# EAGLE schematic CORS_Time_Reference (EAGLE 9.6.2)
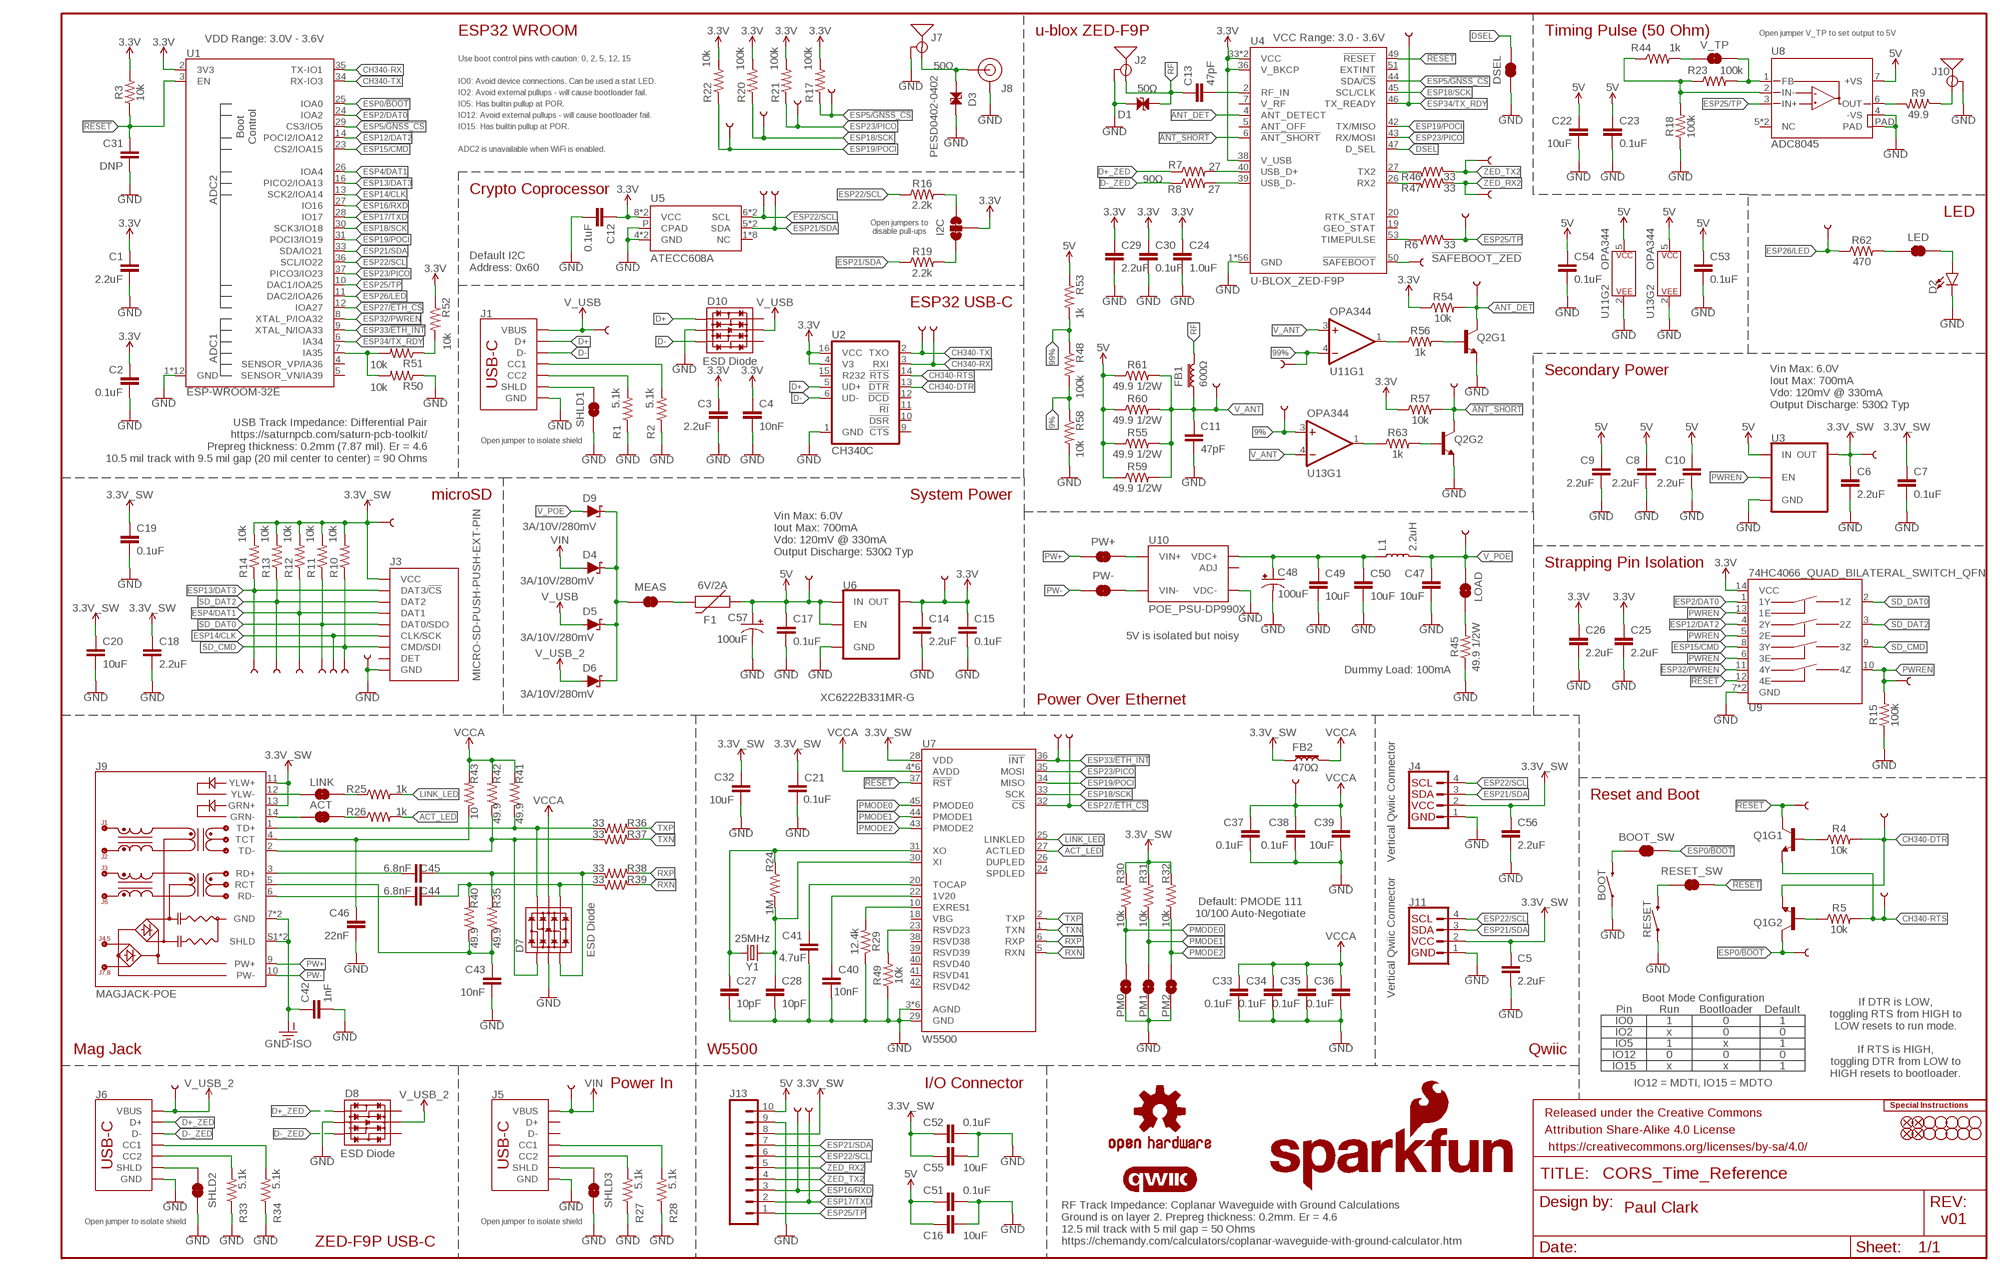
[diagram p0: schematic, sheet 1]

## Parts
3V3  TEST-POINTPOGO_PTH  [1X01_NO_SILK]
3V3_SW  TEST-POINTPOGO_PTH  [1X01_NO_SILK]
5V  TEST-POINTPOGO_PTH  [1X01_NO_SILK]
9%  TEST-POINTPOGO_PTH  [1X01_NO_SILK]
99%  TEST-POINTPOGO_PTH  [1X01_NO_SILK]
!SAFEBOOT_ZED!  TEST-POINTPOGO_PTH  [1X01_NO_SILK]
ACT  JUMPER-SMT_2_NC_TRACE_SILK  [SMT-JUMPER_2_NC_TRACE_SILK]
ANT_DET  TEST-POINTPOGO_PTH  [1X01_NO_SILK]
ANT_SHT  TEST-POINTPOGO_PTH  [1X01_NO_SILK]
BOOT  MOMENTARY-SWITCH-SPST-PTH-RIGHT-ANGLE-8-020  [TACTILE_SWITCH_PTH_RA_8-020]
BOOT_SW  JUMPER-SMT_2_NC_TRACE_SILK  [SMT-JUMPER_2_NC_TRACE_SILK]
C1  2.2uF  2.2UF-0603-10V-20%  [0603]
C2  0.1uF  0.1UF-0603-25V-5%  [0603]
C3  2.2uF  2.2UF-0603-10V-20%  [0603]
C4  10nF  10NF-0603-50V-10%  [0603]
C5  2.2uF  2.2UF-0603-10V-20%  [0603]
C6  2.2uF  2.2UF-0603-10V-20%  [0603]
C7  0.1uF  0.1UF-0603-25V-5%  [0603]
C8  2.2uF  2.2UF-0603-10V-20%  [0603]
C9  2.2uF  2.2UF-0603-10V-20%  [0603]
C10  2.2uF  2.2UF-0603-10V-20%  [0603]
C11  47pF  47PF-0603-50V-5%  [0603]
C12  0.1uF  0.1UF-0603-25V-5%  [0603]
C13  47pF  47PF-0603-50V-5%  [0603]
C14  2.2uF  2.2UF-0603-10V-20%  [0603]
C15  0.1uF  0.1UF-0603-25V-5%  [0603]
C16  10uF  10UF-0805-25V-10%  [0805]
C17  0.1uF  0.1UF-0603-25V-5%  [0603]
C18  2.2uF  2.2UF-0603-10V-20%  [0603]
C19  0.1uF  0.1UF-0603-25V-5%  [0603]
C20  10uF  10UF-0603-6.3V-20%  [0603]
C21  0.1uF  0.1UF-0603-25V-5%  [0603]
C22  10uF  10UF-0603-6.3V-20%  [0603]
C23  0.1uF  0.1UF-0603-25V-5%  [0603]
C24  1.0uF  1.0UF-0603-16V-10%  [0603]
C25  2.2uF  2.2UF-0603-10V-20%  [0603]
C26  2.2uF  2.2UF-0603-10V-20%  [0603]
C27  10pF  10PF-0603-50V-5%  [0603]
C28  10pF  10PF-0603-50V-5%  [0603]
C29  2.2uF  2.2UF-0603-10V-20%  [0603]
C30  0.1uF  0.1UF-0603-25V-5%  [0603]
C31  DNP  DNP-0603_NO_CREAM  [0603_NO_CREAM]
C32  10uF  10UF-0603-6.3V-20%  [0603]
C33  0.1uF  0.1UF-0603-25V-5%  [0603]
C34  0.1uF  0.1UF-0603-25V-5%  [0603]
C35  0.1uF  0.1UF-0603-25V-5%  [0603]
C36  0.1uF  0.1UF-0603-25V-5%  [0603]
C37  0.1uF  0.1UF-0603-25V-5%  [0603]
C38  0.1uF  0.1UF-0603-25V-5%  [0603]
C39  10uF  10UF-0603-6.3V-20%  [0603]
C40  10nF  10NF-0603-50V-10%  [0603]
C41  4.7uF  4.7UF-0603-6.3V-(10%)  [0603]
C42  1nF  1.0NF/1000PF-1206-2KV-10%  [1206]
C43  10nF  10NF-0603-50V-10%  [0603]
C44  6.8nF  6.8NF/6800PF-0603-50V-5%  [0603]
C45  6.8nF  6.8NF/6800PF-0603-50V-5%  [0603]
C46  22nF  22NF/22,000PF-0603-50V-10%  [0603]
C47  10uF  10UF-0805-25V-10%  [0805]
C48  100uF  100UF-POLAR-25V-20%(ELEC)  [PANASONIC_D]
C49  10uF  10UF-0805-25V-10%  [0805]
C50  10uF  10UF-0805-25V-10%  [0805]
C51  0.1uF  0.1UF-0603-25V-5%  [0603]
C52  0.1uF  0.1UF-0603-25V-5%  [0603]
C53  0.1uF  0.1UF-0603-25V-5%  [0603]
C54  0.1uF  0.1UF-0603-25V-5%  [0603]
C55  10uF  10UF-0603-6.3V-20%  [0603]
C56  2.2uF  2.2UF-0603-10V-20%  [0603]
C57  100uF  100UF-POLAR-25V-20%(ELEC)  [PANASONIC_D]
CLK  TEST-POINTPOGO_PTH  [1X01_NO_SILK]
CMD  TEST-POINTPOGO_PTH  [1X01_NO_SILK]
CMD1  TEST-POINTPOGO_PTH  [1X01_NO_SILK]
D1  PESD0402-0402  [0402]
D2  LED-RIGHT-ANGLE-PTH-BLUE  [CBI-RIGHT-ANGLE-PTH]
D3  PESD0402-0402  [0402]
D4  3A/10V/280mV  DIODE-SCHOTTKY-BAT60A  [SOD-323]
D5  3A/10V/280mV  DIODE-SCHOTTKY-BAT60A  [SOD-323]
D6  3A/10V/280mV  DIODE-SCHOTTKY-BAT60A  [SOD-323]
D7  ESD Diode  TVS_DIODE_ARRAY_DT1042-04SO-7  [SOT-23-6]
D8  ESD Diode  TVS_DIODE_ARRAY_DT1042-04SO-7  [SOT-23-6]
D9  3A/10V/280mV  DIODE-SCHOTTKY-BAT60A  [SOD-323]
D10  ESD Diode  TVS_DIODE_ARRAY_DT1042-04SO-7  [SOT-23-6]
DAT0  TEST-POINTPOGO_PTH  [1X01_NO_SILK]
DAT1  TEST-POINTPOGO_PTH  [1X01_NO_SILK]
DAT2  TEST-POINTPOGO_PTH  [1X01_NO_SILK]
DAT3  TEST-POINTPOGO_PTH  [1X01_NO_SILK]
DSEL  JUMPER-SMT_2_NC_TRACE_SILK  [SMT-JUMPER_2_NC_TRACE_SILK]
DTR  TEST-POINTPOGO_PTH  [1X01_NO_SILK]
ETH_CS  TEST-POINTPOGO_PTH  [1X01_NO_SILK]
ETH_INT  TEST-POINTPOGO_PTH  [1X01_NO_SILK]
F1  6V/2A  PPTC_6V2A  [1210]
FB1  600Ω  FERRITE_BEAD-0805-600Ω-100MHZ  [0805]
FB2  470Ω  FERRITE_BEAD-0603-470Ω-100MHZ-1A-200MILIΩ  [0603]
FD1  FIDUCIAL1X2  [FIDUCIAL-1X2]
FD2  FIDUCIAL1X2  [FIDUCIAL-1X2]
FD3  FIDUCIAL1X2  [FIDUCIAL-1X2]
FD4  FIDUCIAL1X2  [FIDUCIAL-1X2]
FRAME1  FRAME-LEDGER  [CREATIVE_COMMONS]
GNSS_CS  TEST-POINTPOGO_PTH  [1X01_NO_SILK]
H1  STAND-OFFTIGHT  [STAND-OFF-TIGHT]
H2  STAND-OFFTIGHT  [STAND-OFF-TIGHT]
H3  STAND-OFFTIGHT  [STAND-OFF-TIGHT]
H4  STAND-OFFTIGHT  [STAND-OFF-TIGHT]
H5  STAND-OFFTIGHT  [STAND-OFF-TIGHT]
H6  STAND-OFFTIGHT  [STAND-OFF-TIGHT]
H7  STAND-OFFTIGHT  [STAND-OFF-TIGHT]
H8  STAND-OFFTIGHT  [STAND-OFF-TIGHT]
H9  STAND-OFFTIGHT  [STAND-OFF-TIGHT]
H10  STAND-OFFTIGHT  [STAND-OFF-TIGHT]
I2C  JUMPER-SMT_3_2-NC_TRACE_SILK  [SMT-JUMPER_3_2-NC_TRACE_SILK]
J1  USB_C_4-LAYER_PADS  [USB-C-16P_4LAYER-PADS]
J2  ANTENNA-SMA-GROUNDEDEDGE_SMA  [SMA-EDGE]
J3  MICRO-SD-PUSH-PUSH-EXT-PIN  [MICROSD-EXTERNALPIN]
J4  Vertical Qwiic Connector  QWIIC_CONNECTOR  [JST04_1MM_VERT]
J5  USB_C_4-LAYER_PADS  [USB-C-16P_4LAYER-PADS]
J6  USB_C_4-LAYER_PADS  [USB-C-16P_4LAYER-PADS]
J7  ANTENNA-SMA-GROUNDEDEDGE_RPSMA  [RP-SMA-EDGE]
J8  U.FL2PIN-REDUCED-FOOTPRINT  [U.FL_REDUCED_FOOTPRINT]
J9  MAGJACK-POE  [MAGJACK-SYM_LED]
J10  ANTENNA-SMA-GROUNDEDEDGE_SMA  [SMA-EDGE]
J11  Vertical Qwiic Connector  QWIIC_CONNECTOR  [JST04_1MM_VERT]
J13  CONN_10_3.5MM_RA_HEADER  [1X10_SCREW_TERMINAL_3.5MM]
L1  2.2uH  INDUCTOR-0805_WIDE-2.2UH  [0805-WIDE]
LED  JUMPER-SMT_2_NC_TRACE_SILK  [SMT-JUMPER_2_NC_TRACE_SILK]
LINK  JUMPER-SMT_2_NC_TRACE_SILK  [SMT-JUMPER_2_NC_TRACE_SILK]
LOAD  JUMPER-SMT_2_NC_TRACE_SILK  [SMT-JUMPER_2_NC_TRACE_SILK]
LOGO1  SPECIAL_INSTRUCTIONS-ORDERING  [ORDERING_INSTRUCTIONS]
LOGO3  QWIIC_LOGO_6MM  [QWIIC_6MM]
LOGO4  OSHW-LOGOS  [OSHW-LOGO-S]
LOGO5  SFE_LOGO_NAME.2_INCH  [SFE_LOGO_NAME_.2]
LOGO6  SFE_LOGO_FLAME.2_INCH  [SFE_LOGO_FLAME_.2]
MEAS  JUMPER-COMBO_2_NC_TRACE  [COMBO-JUMPER_2_NC_TRACE]
PICO  TEST-POINTPOGO_PTH  [1X01_NO_SILK]
PM0  JUMPER-SMT_2_NO_SILK  [SMT-JUMPER_2_NO_SILK]
PM1  JUMPER-SMT_2_NO_SILK  [SMT-JUMPER_2_NO_SILK]
PM2  JUMPER-SMT_2_NO_SILK  [SMT-JUMPER_2_NO_SILK]
POCI  TEST-POINTPOGO_PTH  [1X01_NO_SILK]
PW+  JUMPER-COMBO_2_NC_TRACE  [COMBO-JUMPER_2_NC_TRACE]
PW-  JUMPER-COMBO_2_NC_TRACE  [COMBO-JUMPER_2_NC_TRACE]
PWREN  TEST-POINTPOGO_PTH  [1X01_NO_SILK]
Q1  TRANS_NPN_DUAL-MBT3904DW1T1  [SC70-6]
Q2  TRANS_NPN_DUAL-MBT3904DW1T1  [SC70-6]
R1  5.1k  5.1KOHM5.1KOHM-0603-1/10W-1%  [0603]
R2  5.1k  5.1KOHM5.1KOHM-0603-1/10W-1%  [0603]
R3  10k  10KOHM-0603-1/10W-1%  [0603]
R4  10k  10KOHM-0603-1/10W-1%  [0603]
R5  10k  10KOHM-0603-1/10W-1%  [0603]
R6  33  33OHM-0603-1/10W-1%  [0603]
R7  27  27OHM-0603-1/10W-1%  [0603]
R8  27  27OHM-0603-1/10W-1%  [0603]
R9  49.9  49.9OHM-0603-1/10W-1%  [0603]
R10  10k  10KOHM-0603-1/10W-1%  [0603]
R11  10k  10KOHM-0603-1/10W-1%  [0603]
R12  10k  10KOHM-0603-1/10W-1%  [0603]
R13  10k  10KOHM-0603-1/10W-1%  [0603]
R14  10k  10KOHM-0603-1/10W-1%  [0603]
R15  100k  100KOHM-0603-1/10W-1%  [0603]
R16  2.2k  2.2KOHM-0603-1/10W-1%  [0603]
R17  100k  100KOHM-0603-1/10W-1%  [0603]
R18  100k  100KOHM-0603-1/10W-1%  [0603]
R19  2.2k  2.2KOHM-0603-1/10W-1%  [0603]
R20  100k  100KOHM-0603-1/10W-1%  [0603]
R21  100k  100KOHM-0603-1/10W-1%  [0603]
R22  10k  10KOHM-0603-1/10W-1%  [0603]
R23  100k  100KOHM-0603-1/10W-1%  [0603]
R24  1M  1MOHM-0603-1/4W-5%  [0603]
R25  1k  1KOHM-0603-1/10W-1%  [0603]
R26  1k  1KOHM-0603-1/10W-1%  [0603]
R27  5.1k  5.1KOHM5.1KOHM-0603-1/10W-1%  [0603]
R28  5.1k  5.1KOHM5.1KOHM-0603-1/10W-1%  [0603]
R29  12.4k  12.4KOHM-0603-1/10W-1%  [0603]
R30  10k  10KOHM-0603-1/10W-1%  [0603]
R31  10k  10KOHM-0603-1/10W-1%  [0603]
R32  10k  10KOHM-0603-1/10W-1%  [0603]
R33  5.1k  5.1KOHM5.1KOHM-0603-1/10W-1%  [0603]
R34  5.1k  5.1KOHM5.1KOHM-0603-1/10W-1%  [0603]
R35  49.9  49.9OHM-0603-1/10W-1%  [0603]
R36  33  33OHM-0603-1/10W-1%  [0603]
R37  33  33OHM-0603-1/10W-1%  [0603]
R38  33  33OHM-0603-1/10W-1%  [0603]
R39  33  33OHM-0603-1/10W-1%  [0603]
R40  49.9  49.9OHM-0603-1/10W-1%  [0603]
R41  49.9  49.9OHM-0603-1/10W-1%  [0603]
R42  49.9  49.9OHM-0603-1/10W-1%  [0603]
R43  10  10OHM-0603-1/10W-1%  [0603]
R44  1k  1KOHM-0603-1/10W-1%  [0603]
R45  49.9 1/2W  49.9OHM-1206-1/2W-1%  [1206]
R46  33  33OHM-0603-1/10W-1%  [0603]
R47  33  33OHM-0603-1/10W-1%  [0603]
R48  100k  100KOHM-0603-1/10W-1%  [0603]
R49  10k  10KOHM-0603-1/10W-1%  [0603]
R50  10k  10KOHM-0603-1/10W-1%  [0603]
R51  10k  10KOHM-0603-1/10W-1%  [0603]
R52  10k  10KOHM-0603-1/10W-1%  [0603]
R53  1k  1KOHM-0603-1/10W-1%  [0603]
R54  10k  10KOHM-0603-1/10W-1%  [0603]
R55  49.9 1/2W  49.9OHM-1206-1/2W-1%  [1206]
R56  1k  1KOHM-0603-1/10W-1%  [0603]
R57  10k  10KOHM-0603-1/10W-1%  [0603]
R58  10k  10KOHM-0603-1/10W-1%  [0603]
R59  49.9 1/2W  49.9OHM-1206-1/2W-1%  [1206]
R60  49.9 1/2W  49.9OHM-1206-1/2W-1%  [1206]
R61  49.9 1/2W  49.9OHM-1206-1/2W-1%  [1206]
R62  470  470OHM-0603-1/10W-1%  [0603]
R63  1k  1KOHM-0603-1/10W-1%  [0603]
RESET  MOMENTARY-SWITCH-SPST-PTH-RIGHT-ANGLE-8-020  [TACTILE_SWITCH_PTH_RA_8-020]
RESET_SW  JUMPER-SMT_2_NC_TRACE_SILK  [SMT-JUMPER_2_NC_TRACE_SILK]
RTS  TEST-POINTPOGO_PTH  [1X01_NO_SILK]
RX  TEST-POINTPOGO_PTH  [1X01_NO_SILK]
RX2  TEST-POINTPOGO_PTH  [1X01_NO_SILK]
RXD  TEST-POINTPOGO_PTH  [1X01_NO_SILK]
SCK  TEST-POINTPOGO_PTH  [1X01_NO_SILK]
SCL  TEST-POINTPOGO_PTH  [1X01_NO_SILK]
SDA  TEST-POINTPOGO_PTH  [1X01_NO_SILK]
SHLD1  JUMPER-SMT_2_NC_TRACE_SILK  [SMT-JUMPER_2_NC_TRACE_SILK]
SHLD2  JUMPER-SMT_2_NC_TRACE_SILK  [SMT-JUMPER_2_NC_TRACE_SILK]
SHLD3  JUMPER-SMT_2_NC_TRACE_SILK  [SMT-JUMPER_2_NC_TRACE_SILK]
TP  TEST-POINTPOGO_PTH  [1X01_NO_SILK]
TP_BOOT  TEST-POINTPOGO_PTH  [1X01_NO_SILK]
TP_LED  TEST-POINTPOGO_PTH  [1X01_NO_SILK]
TP_RESET  TEST-POINTPOGO_PTH  [1X01_NO_SILK]
TX  TEST-POINTPOGO_PTH  [1X01_NO_SILK]
TX2  TEST-POINTPOGO_PTH  [1X01_NO_SILK]
TX_RDY  TEST-POINTPOGO_PTH  [1X01_NO_SILK]
TXD  TEST-POINTPOGO_PTH  [1X01_NO_SILK]
U1  ESP-WROOM-32E  ESP-WROOM-32EU  [ESP-WROOM-32EU]
U2  CH340C  [SO016]
U3  XC6222B331MR-G  [SOT23-5]
U4  U-BLOX_ZED-F9P  [ZED-F9P]
U5  ATECC608A  ATECC608ADUAL_PACKAGE_UDFN_SOIC-8  [DUAL_UDFN_2X3MM_SOIC-8]
U6  XC6222B331MR-G  [SOT23-5]
U7  W5500  [LQFP-48]
U8  ADC8045  AD8045-PAD  [SO08_PAD]
U9  74HC4066_QUAD_BILATERAL_SWITCH_QFN  [14-QFN]
U10  POE_PSU-DP990X  [DP990X]
U11  OPA344  [SOT23-5]
U13  OPA344  [SOT23-5]
V_TP  JUMPER-SMT_2_NC_TRACE_SILK  [SMT-JUMPER_2_NC_TRACE_SILK]
VANT  TEST-POINTPOGO_PTH  [1X01_NO_SILK]
VCCA  TEST-POINTPOGO_PTH  [1X01_NO_SILK]
VIN  TEST-POINTPOGO_PTH  [1X01_NO_SILK]
VPOE  TEST-POINTPOGO_PTH  [1X01_NO_SILK]
VPOE7  TEST-POINTPOGO_PTH  [1X01_NO_SILK]
VUSB  TEST-POINTPOGO_PTH  [1X01_NO_SILK]
VUSB2  TEST-POINTPOGO_PTH  [1X01_NO_SILK]
Y1  25MHz  CRYSTAL-25MHZ-SMD-2.0X1.6MM  [CRYSTAL-SMD-2.0X1.6MM]

## Nets
3.3V: 3V3.1 C1.1 C2.1 C3.1 C4.1 C12.1 C14.1 C15.1 C24.1 C25.1 C26.1 C29.1 C30.1 I2C.2 R3.2 R17.2 R20.2 R21.2 R22.2 R52.1 R54.1 R57.1 U1.2(3V3) U2.4(V3) U2.16(VCC) U4.33(VCC) U4.34(VCC) U4.36(V_BKCP) U4.38(V_USB) U5.8(VCC) U5.8S(VCC) U6.5(OUT) U9.14(VCC)
3.3V_SW: 3V3_SW.1 C5.1 C6.1 C7.1 C18.1 C19.1 C20.1 C21.1 C32.1 C52.1 C55.1 C56.1 CMD1.1 FB2.1 J3.4(VCC) J4.2 J9.11(YLW+) J9.13(GRN+) J11.2 J13.8 R10.2 R11.2 R12.2 R13.2 R14.2 R30.2 R31.2 R32.2 U3.5(OUT) U7.28(VDD)
5V: 5V.1 C8.1 C9.1 C10.1 C16.1 C17.1 C22.1 C23.1 C51.1 C53.1 C54.1 C57.+ F1.1 J13.10 R53.1 R55.1 R59.1 R60.1 R61.1 U3.1(IN) U6.1(IN) U6.3(EN) U8.7(+VS) U11.5(P$V+) U13.5(P$V+)
5V_RAW: C48.+ C49.1 C50.1 L1.1 U10.1(VDC+) U10.2(VDC+)
9%: 9%.1 R48.2 R58.1 U13.3(+IN)
99%: 99%.1 R48.1 R53.2 U11.4(-IN)
!ANT_SHORT!: ANT_SHT.1 Q2.6(C) R57.2 U4.6(!ANT_SHORT!)
!RESET!: C31.1 Q1.3(C) R3.1 RESET_SW.1 TP_RESET.1 U1.3(EN) U4.49(!RESET!) U7.37(!RST!) U9.12(4E)
!SAFEBOOT_ZED!: !SAFEBOOT_ZED!.1 U4.50(!SAFEBOOT!)
ACT: ACT.1 J9.14(GRN-)
ACT_LED: R26.2 U7.27(ACTLED)
ANT_DET: ANT_DET.1 Q2.3(C) R54.2 U4.4(ANT_DETECT)
CH340-DTR: DTR.1 Q1.1(E) R4.2 U2.13(!DTR)
CH340-RTS: Q1.4(E) R5.2 RTS.1 U2.14(!RTS)
CH340-RX: TX.1 U1.35(TX-IO1) U2.3(RXI)
CH340-TX: RX.1 U1.34(RX-IO3) U2.2(TXO)
D+: D10.1(IO1) J1.A6(D+) J1.B6(D+) U2.5(UD+)
D+_ZED: D8.1(IO1) J6.A6(D+) J6.B6(D+) R7.1
D-: D10.3(IO2) J1.A7(D-) J1.B7(D-) U2.6(UD-)
D-_ZED: D8.3(IO2) J6.A7(D-) J6.B7(D-) R8.1
DSEL: DSEL.2 U4.47(D_SEL)
ESP0/!BOOT!: BOOT_SW.1 Q1.6(C) TP_BOOT.1 U1.25(IOA0)
ESP2/DAT0: U1.24(IOA2) U9.1(1Y)
ESP4/DAT1: DAT1.1 J3.8(DAT1) R12.1 U1.26(IOA4)
ESP5/!GNSS_CS!: GNSS_CS.1 R17.1 U1.29(CS3/IO5) U4.44(SDA/!CS!)
ESP12/DAT2: U1.14(POCI2/IOA12) U9.4(2Y)
ESP13/DAT3: DAT3.1 J3.2(DAT3/!CS!) R14.1 U1.16(PICO2/IOA13)
ESP14/CLK: CLK.1 J3.5(CLK/SCK) U1.13(SCK2/IOA14)
ESP15/CMD: U1.23(CS2/IOA15) U9.8(3Y)
ESP16/RXD: J13.3 RXD.1 U1.27(IO16)
ESP17/TXD: J13.2 TXD.1 U1.28(IO17)
ESP18/SCK: R20.1 SCK.1 U1.30(SCK3/IO18) U4.45(SCL/CLK) U7.33(SCK)
ESP19/POCI: POCI.1 R22.1 U1.31(POCI3/IO19) U4.42(TX/MISO) U7.34(MISO)
ESP21/SDA: J4.3 J11.3 J13.7 R19.1 SDA.1 U1.33(SDA/IO21) U5.5(SDA) U5.5S(SDA)
ESP22/SCL: J4.4 J11.4 J13.6 R16.1 SCL.1 U1.36(SCL/IO22) U5.6(SCL) U5.6S(SCL)
ESP23/PICO: PICO.1 R21.1 U1.37(PICO3/IO23) U4.43(RX/MOSI) U7.35(MOSI)
ESP25/TP: J13.1 R6.2 TP.1 U1.10(DAC1/IOA25) U8.3(IN+)
ESP26/LED: R62.1 TP_LED.1 U1.11(DAC2/IOA26)
ESP27/!ETH_CS!: ETH_CS.1 U1.12(IOA27) U7.32(!CS!)
ESP32/PWREN: U1.8(XTAL_P/IOA32) U9.11(4Y)
ESP33/!ETH_INT!: ETH_INT.1 U1.9(XTAL_N/IOA33) U7.36(!INT!)
ESP34/TX_RDY: TX_RDY.1 U1.6(IA34) U4.46(TX_READY)
GND: BOOT.1 C1.2 C2.2 C3.2 C4.2 C5.2 C6.2 C7.2 C8.2 C9.2 C10.2 C11.2 C12.2 C14.2 C15.2 C16.2 C17.2 C18.2 C19.2 C20.2 C21.2 C22.2 C23.2 C24.2 C25.2 C26.2 C27.2 C28.2 C29.2 C30.2 C31.2 C32.2 C33.2 C34.2 C35.2 C36.2 C37.2 C38.2 C39.2 C40.2 C41.2 C42.2 C43.2 C46.2 C47.2 C48.- C49.2 C50.2 C51.2 C52.2 C53.2 C54.2 C55.2 C56.2 C57.- D1.2 D2.C D3.2 D7.2(VSS) D8.2(VSS) D10.2(VSS) DSEL.1 J1.GND J1.GND2(GND) J2.GND@0(GND) J2.GND@1(GND) J2.GND@2(GND) J2.GND@3(GND) J3.6(GND) J3.10(GND) J3.11(GND) J3.12(GND) J3.13(GND) J4.1 J5.GND J5.GND2(GND) J6.GND J6.GND2(GND) J7.GND@0(GND) J7.GND@1(GND) J7.GND@2(GND) J7.GND@3(GND) J8.1(GND) J8.2(GND) J10.GND@0(GND) J10.GND@1(GND) J10.GND@2(GND) J10.GND@3(GND) J11.1 J13.9 PM0.1 PM1.1 PM2.1 Q2.1(E) Q2.4(E) R1.1 R2.1 R15.1 R18.1 R27.1 R28.1 R29.1 R33.1 R34.1 R45.1 R49.1 R50.1 R58.2 RESET.1 SHLD1.1 SHLD2.1 SHLD3.1 U1.1(GND) U1.15(GND) U1.38(GND) U1.GND U1.GNDT1(GND) U1.GNDT2(GND) U1.GNDT3(GND) U1.GNDT4(GND) U1.GNDT5(GND) U1.GNDT6(GND) U1.GNDT7(GND) U1.GNDT8(GND) U2.1(GND) U3.2(GND) U4.1(GND) U4.3(GND) U4.12(GND) U4.14(GND) U4.32(GND) U4.37(GND) U4.41(GND) U4.48(GND) U4.55(GND) U4.56(GND) U4.57(GND) U4.58(GND) U4.59(GND) U4.60(GND) U4.61(GND) U4.62(GND) U4.63(GND) U4.64(GND) U4.65(GND) U4.66(GND) U4.67(GND) U4.68(GND) U4.69(GND) U4.70(GND) U4.71(GND) U4.72(GND) U4.73(GND) U4.74(GND) U4.75(GND) U4.76(GND) U4.77(GND) U4.78(GND) U4.79(GND) U4.80(GND) U4.81(GND) U4.82(GND) U4.83(GND) U4.84(GND) U4.85(GND) U4.86(GND) U4.87(GND) U4.88(GND) U4.89(GND) U4.90(GND) U4.91(GND) U4.92(GND) U4.93(GND) U4.94(GND) U4.95(GND) U4.96(GND) U4.97(GND) U4.98(GND) U4.99(GND) U4.100(GND) U4.101(GND) U4.102(GND) U5.4(GND) U5.4S(GND) U5.P(CPAD) U6.2(GND) U7.3(AGND) U7.9(AGND) U7.14(AGND) U7.16(AGND) U7.19(AGND) U7.29(GND) U7.48(AGND) U8.4(-VS) U8.PAD U9.7(GND) U9.EPAD(GND) U10.3(VDC-) U11.2(P$V-) U13.2(P$V-) VPOE7.1
GND-ISO: C42.1 J9.7(GND) J9.8(GND) J9.S1(SHLD) J9.S2(SHLD)
LINK: J9.12(YLW-) LINK.1
LINK_LED: R25.2 U7.25(LINKLED)
MEAS: D4.C D5.C D6.C D9.C MEAS.2 MEAS.4
N$1: J1.B5(CC2) R1.2
N$2: J1.A5(CC1) R2.2
N$3: R7.2 U4.40(USB_D+)
N$4: Q1.2(B) R5.1
N$5: Q1.5(B) R4.1
N$6: R8.2 U4.39(USB_D-)
N$7: LED.2 R62.2
N$8: J6.SHLD1(SHLD) J6.SHLD2(SHLD) J6.SHLD3(SHLD) J6.SHLD4(SHLD) SHLD2.2
N$9: J5.B5(CC2) R27.2
N$10: F1.2 MEAS.1 MEAS.3
N$11: R46.1 U4.27(TX2)
N$12: ACT.2 R26.1
N$13: D3.1 J7.SIG(SIGNAL) J8.FEED(SIGNAL)
N$14: I2C.3 R16.2
N$15: I2C.1 R19.2
N$16: R9.2 U8.6(OUT)
N$17: J10.SIG(SIGNAL) R9.1
N$18: R18.2 R23.1 R44.1 U8.2(IN-)
N$19: C27.1 R24.1 U7.31(XO) Y1.1
N$20: C28.1 R24.2 U7.30(XI) Y1.3
N$21: LINK.2 R25.1
N$22: J5.A5(CC1) R28.2
N$23: R29.2 U7.10(EXRES1)
N$24: C40.1 U7.22(1V20)
N$25: C41.1 U7.20(TOCAP)
N$26: R23.2 U8.1(FB) V_TP.2
N$27: LOAD.1 R45.2
N$28: RESET.2 RESET_SW.2
N$29: BOOT.2 BOOT_SW.2
N$30: R49.2 U7.23(RSVD23)
N$31: R44.2 V_TP.1
N$32: R47.1 U4.26(RX2)
N$33: J6.B5(CC2) R33.2
N$34: J6.A5(CC1) R34.2
N$35: R56.1 U11.1(OUT)
N$36: R6.1 U4.53(TIMEPULSE)
N$37: R50.2 R51.2 U1.7(IA35)
N$38: Q2.5(B) R56.2
N$39: R51.1 R52.2
N$40: Q2.2(B) R63.2
N$41: R63.1 U13.1(OUT)
N$42: C13.2 U4.2(RF_IN)
N$43: J5.SHLD1(SHLD) J5.SHLD2(SHLD) J5.SHLD3(SHLD) J5.SHLD4(SHLD) SHLD3.2
N$45: D2.A LED.1
PMODE0: PM0.2 R30.1 U7.45(PMODE0)
PMODE1: PM1.2 R31.1 U7.44(PMODE1)
PMODE2: PM2.2 R32.1 U7.43(PMODE2)
PW1+: PW+.1 PW+.3 U10.5(VIN+) U10.6(VIN+)
PW1-: PW-.1 PW-.3 U10.7(VIN-) U10.8(VIN-)
PW+: J9.9(PW+) PW+.2 PW+.4
PW-: J9.10(PW-) PW-.2 PW-.4
PWREN: PWREN.1 R15.2 U3.3(EN) U9.5(2E) U9.6(3E) U9.10(4Z) U9.13(1E)
RCT: C43.1 J9.5(RCT) R35.1 R40.1
RD+: C45.2 J9.3(RD+)
RD-: C44.2 J9.6(RD-)
RF: C13.1 D1.1 FB1.2 J2.SIG(SIGNAL)
RXN: R39.1 U7.5(RXN)
RXN1: C44.1 D7.4(IO3) R39.2 R40.2
RXP: R38.1 U7.6(RXP)
RXP1: C45.1 D7.3(IO2) R35.2 R38.2
SD_CMD: CMD.1 J3.3(CMD/SDI) R10.1 U9.9(3Z)
SD_DAT0: DAT0.1 J3.7(DAT0/SDO) R11.1 U9.2(1Z)
SD_DAT2: DAT2.1 J3.1(DAT2) R13.1 U9.3(2Z)
SHIELD: J1.SHLD1(SHLD) J1.SHLD2(SHLD) J1.SHLD3(SHLD) J1.SHLD4(SHLD) SHLD1.2
TCT: C46.1 J9.4(TCT) R43.1
TD+: D7.6(IO4) J9.1(TD+) R36.2 R41.1
TD-: D7.1(IO1) J9.2(TD-) R37.2 R42.1
TXN: R37.1 U7.1(TXN)
TXP: R36.1 U7.2(TXP)
V_ANT: C11.1 FB1.1 R55.2 R59.2 R60.2 R61.2 U11.3(+IN) U13.4(-IN) VANT.1
V_POE: C47.1 D9.A L1.2 LOAD.2 VPOE.1
V_USB: D5.A D10.5(VCC) J1.VBUS1(VBUS) J1.VBUS2(VBUS) VUSB.1
V_USB_2: D6.A D8.5(VCC) J6.VBUS1(VBUS) J6.VBUS2(VBUS) VUSB2.1
VCCA: C33.1 C34.1 C35.1 C36.1 C37.1 C38.1 C39.1 D7.5(VCC) FB2.2 R41.2 R42.2 R43.2 U7.4(AVDD) U7.8(AVDD) U7.11(AVDD) U7.15(AVDD) U7.17(AVDD) U7.21(AVDD) VCCA.1
VIN: D4.A J5.VBUS1(VBUS) J5.VBUS2(VBUS) VIN.1
ZED_RX2: J13.5 R47.2 RX2.1
ZED_TX2: J13.4 R46.2 TX2.1
Unconnected: D8.4(IO3) D8.6(IO4) D10.4(IO3) D10.6(IO4) J3.9(DET) J5.A6(D+) J5.A7(D-) J5.B6(D+) J5.B7(D-) U1.4(SENSOR_VP/IA36) U1.5(SENSOR_VN/IA39) U2.9(!CTS) U2.10(!DSR) U2.11(!RI) U2.12(!DCD) U2.15(R232) U4.5(ANT_OFF) U4.7(V_RF) U4.19(GEO_STAT) U4.20(RTK_STAT) U4.51(EXTINT) U5.1(NC) U5.1S(NC) U5.2(NC) U5.2S(NC) U5.3(NC) U5.3S(NC) U5.7(NC) U5.7S(NC) U7.18(VBG) U7.24(SPDLED) U7.26(DUPLED) U7.38(RSVD38) U7.39(RSVD39) U7.40(RSVD40) U7.41(RSVD41) U7.42(RSVD42) U8.5(NC) U8.8(NC) U10.4(ADJ)

## Notes on the sheet
- u-blox ZED-F9P | Timing Pulse (50 Ohm)
- VDD Range: 3.0V - 3.6V | ESP32 WROOM | Open jumper V_TP to set output to 5V
- VCC Range: 3.0 - 3.6V
- Use boot control pins with caution: 0, 2, 5, 12, 15
- 50Ω
- IO0: Avoid device connections. Can be used a stat LED.
- IO2: Avoid external pullups - will cause bootloader fail. | 50Ω
- IO5: Has builtin pullup at POR.
- IO12: Avoid external pullups - will cause bootloader fail.
- IO15: Has builtin pullup at POR.
- ADC2 is unavailable when WiFi is enabled.
- Crypto Coprocessor | 90Ω
- LED
- Open jumpers to
  disable pull-ups
- Default I2C
  Address: 0x60
- ESP32 USB-C
- Secondary Power
- Vin Max: 6.0V
  Iout Max: 700mA
  Vdo: 120mV @ 330mA
  Output Discharge: 530Ω Typ
- USB Track Impedance: Differential Pair
  https://saturnpcb.com/saturn-pcb-toolkit/
  Prepreg thickness: 0.2mm (7.87 mil). Er = 4.6
  10.5 mil track with 9.5 mil gap (20 mil center to center) = 90 Ohms
- Open jumper to isolate shield
- microSD | System Power
- Vin Max: 6.0V
  Iout Max: 700mA
  Vdo: 120mV @ 330mA
  Output Discharge: 530Ω Typ
- Strapping Pin Isolation
- 5V is isolated but noisy
- Dummy Load: 100mA
- Power Over Ethernet
- Reset and Boot
- Default: PMODE 111
  10/100 Auto-Negotiate
- Boot Mode Configuration
- If DTR is LOW,
  toggling RTS from HIGH to
  LOW resets to run mode.
  
  If RTS is HIGH,
  toggling DTR from LOW to
  HIGH resets to bootloader.
- Pin | Run | Bootloader | Default
- IO0 | 1 | 0 | 1
- IO2 | x | 0 | 0
- IO5 | 1 | x | 1
- Mag Jack | W5500 | Qwiic | IO12 | 0 | 0 | 0
- IO15 | x | x | 1
- Power In | I/O Connector
- IO12 = MDTI, IO15 = MDTO
- Paul Clark
- Open jumper to isolate shield | Open jumper to isolate shield | v01
- RF Track Impedance: Coplanar Waveguide with Ground Calculations
  Ground is on layer 2. Prepreg thickness: 0.2mm. Er = 4.6
  12.5 mil track with 5 mil gap = 50 Ohms
  https://chemandy.com/calculators/coplanar-waveguide-with-ground-calculator.htm
- ZED-F9P USB-C

## Library data of the parts
3V3 3V3_SW 5V 9% 99% !SAFEBOOT_ZED! ANT_DET ANT_SHT CLK CMD CMD1 DAT0 DAT1-DAT3 DTR ETH_CS ETH_INT GNSS_CS PICO POCI PWREN RTS RX RX2 RXD SCK SCL SDA TP TP_BOOT TP_LED TP_RESET TX TX2 TX_RDY TXD VANT VCCA VIN VPOE VPOE7 VUSB VUSB2 = SparkFun-Connectors:TEST-POINT: SparkFun Test Points Bare copper test points for troubleshooting or In-Circuit-Testing. These are used by our Production team for verifying production board runs using pogo-pins on test beds. SparkFun Products: SparkFun LSM9DS1 Breakout <https://www.sparkfun.com/products/13284> SparkFun PSOC <https://www.sparkfun.com/products/13714> SparkFun Load Cell Amplifier <https://www.sparkfun.com/products/13879>
ACT BOOT_SW DSEL LED LINK LOAD RESET_SW SHLD1-SHLD3 V_TP = SparkFun-Jumpers:JUMPER-SMT_2_NC_TRACE: Normally closed trace jumper This jumper has a trace between two pads so it's normally closed (NC). Use a razor knife to open the connection. For best results follow the IPC guidelines for cutting traces: Cutout at least 0.063 mm (0.005 in). Remove all loose material to clean up the cut area. Seal the cut with an approved epoxy. Reapply solder to reclose the connection.
BOOT RESET = SparkFun-Switches:MOMENTARY-SWITCH-SPST: Momentary Switch (Pushbutton) - SPST Normally-open (NO) SPST momentary switches (buttons, pushbuttons). Variants PTH-12MM - 12mm square, through-hole Momentary Pushbutton Switch - 12mm Square <https://www.sparkfun.com/products/9190> (COM-09190) PTH-6.0MM, PTH-6.0MM-KIT - 6.0mm square, through-hole Mini Pushbutton Switch <https://www.sparkfun.com/products/97> (COM-00097) KIT package intended for soldering kit's - only one side of pads' copper is exposed. PTH-RIGHT-ANGLE-KIT - Right-angle, through-hole Right Angle Tactile Button <https://www.sparkfun.com/products/10791> - Used on SparkFun BigTime Watch Kit <https://www.sparkfun.com/products/11734> SMD-12MM - 12mm square, surface-mount Tactile Button - SMD (12mm) <https://www.sparkfun.com/products/12993> (COM-12993) Used on SparkFun PicoBoard <https://www.sparkfun.com/products/11888> SMD-4.5MM - 4.5mm Square Trackball Switch Used on SparkFun Blackberry Trackballer Breakout <https://www.sparkfun.com/products/13169> SMD-4.6MMX2.8MM - 4.60mm x 2.80mm, surface mount Used on SparkFun Pro Micro - RP2040 <https://www.sparkfun.com/products/17717> SMD-5.2MM, SMD-5.2-REDUNDANT - 5.2mm square, surface-mount Mini Pushbutton Switch - SMD <https://www.sparkfun.com/products/8720> (COM-08720) Used on Arduino Pro Mini <https://www.sparkfun.com/products/11114> REDUNDANT package connects both switch circuits together SMD-6.0X3.5MM - 6.0 x 3.5mm, surface mount Momentary Reset Switch SMD <https://www.sparkfun.com/products/8229> (COM-08229) SMD-6.2MM-TALL - 6.2mm square, surface mount Tactile Button - SMD (6mm) <https://www.sparkfun.com/products/12992> Used on SparkFun Digital Sandbox <https://www.sparkfun.com/products/12651> SMD-RIGHT-ANGLE - Right-angle, surface mount Used on SparkFun Block for Intel® Edison - Arduino <https://www.sparkfun.com/products/13036>; PROD_ID: SWCH-13896
C1 C3 C5 C6 C8-C10 C14 C18 C25 C26 C29 C56 = SparkFun-Capacitors:2.2UF: 2.2µF ceramic capacitors A capacitor is a passive two-terminal electrical component used to store electrical energy temporarily in an electric field.; PROD_ID: CAP-07888
C2 C7 C12 C15 C17 C19 C21 C23 C30 C33-C38 C51-C54 = SparkFun-Capacitors:0.1UF: 0.1µF ceramic capacitors A capacitor is a passive two-terminal electrical component used to store electrical energy temporarily in an electric field.; PROD_ID: CAP-08604
C4 C40 C43 = SparkFun-Capacitors:10NF: 0.01uF/10nF/10,000pF ceramic capacitors A capacitor is a passive two-terminal electrical component used to store electrical energy temporarily in an electric field. CAP-09321; PROD_ID: CAP-00867
C11 C13 = SparkFun-Capacitors:47PF: 47pF ceramic capacitors A capacitor is a passive two-terminal electrical component used to store electrical energy temporarily in an electric field.; PROD_ID: CAP-08913
C16 C47 C49 C50 = SparkFun-Capacitors:10UF: 10.0µF ceramic capacitors A capacitor is a passive two-terminal electrical component used to store electrical energy temporarily in an electric field.; PROD_ID: CAP-14259
C20 C22 C32 C39 C55 = SparkFun-Capacitors:10UF: 10.0µF ceramic capacitors A capacitor is a passive two-terminal electrical component used to store electrical energy temporarily in an electric field.; PROD_ID: CAP-11015
C24 = SparkFun-Capacitors:1.0UF: 1µF ceramic capacitors A capacitor is a passive two-terminal electrical component used to store electrical energy temporarily in an electric field.; PROD_ID: CAP-00868
C27 C28 = SparkFun-Capacitors:10PF: 10pF ceramic capacitors A capacitor is a passive two-terminal electrical component used to store electrical energy temporarily in an electric field.; PROD_ID: CAP-11812
C31 = SparkFun-Capacitors:DNP: Do-Not-Populate capacitor
C41 = SparkFun-Capacitors:4.7UF: 4.7µF ceramic capacitors A capacitor is a passive two-terminal electrical component used to store electrical energy temporarily in an electric field.; PROD_ID: CAP-08280
C42 = SparkFun-Capacitors:1.0NF/1000PF: 1nF/1,000pF ceramic capacitors A capacitor is a passive two-terminal electrical component used to store electrical energy temporarily in an electric field.; PROD_ID: CAP-16238
C44 C45 = SparkFun-Capacitors:6.8NF/6800PF: 5.6nF/5600pF ceramic capacitors A capacitor is a passive two-terminal electrical component used to store electrical energy temporarily in an electric field.; PROD_ID: CAP-16239
C46 = SparkFun-Capacitors:22NF/22,000PF: 0.022uF/22nF/22,000pF ceramic capacitors A capacitor is a passive two-terminal electrical component used to store electrical energy temporarily in an electric field.; PROD_ID: CAP-07885
C48 C57 = SparkFun-Capacitors:100UF-POLAR: 100µF polarized capacitors A capacitor is a passive two-terminal electrical component used to store electrical energy temporarily in an electric field.; PROD_ID: CAP-12547
D1 D3 = SparkFun-DiscreteSemi:PESD0402: ESD protection diode PESD is used to protect a signal line from ESD.; DIGIKEY_PART: PESD0402-140CT-ND; MOUSE_PART: 650-PESD0402-140; PROD_ID: DIO-15359
D2 = SparkFun-LED:LED-RIGHT-ANGLE-PTH; PROD_ID: DIO-13890
D4-D6 D9 = SparkFun-DiscreteSemi:DIODE-SCHOTTKY: Schottky diode A Schottky diode is a semiconductor diode which has a low forward voltage drop and a very fast switching action.; PROD_ID: DIO-14072
D7 D8 D10 = SparkFun-DiscreteSemi:TVS_DIODE_ARRAY; PROD_ID: IC-13538
F1 = SparkFun-Fuses:PPTC: Resettable Fuse PPTC Resettable Fuse. Really a sort of resistor with a polymeric positive temperature coefficient whose resistance increases dramatically with an increase in temperature. When heated by the power passing through the resistance rises causing the current to be limited, protecting the circuit. This is achieved by the transition of the polymer from a crystalline to an amorphous state where the conductive carbon separates breaking the conductive pathways found in the cool crystalline structure. When a PPTC cools back down it resumes conducting letting the circuit turn back on. SparkFun Products: SparkFun RedBoard - Programmed with Arduino <https://www.sparkfun.com/products/12757> Pro Micro - 5V/16MHz <https://www.sparkfun.com/products/12640> Arduino Pro 328 - 5V/16MHz <https://www.sparkfun.com/products/10915> MP3 Trigger <https://www.sparkfun.com/products/13720>; PROD_ID: RES-14313
FB1 = SparkFun-Coils:FERRITE_BEAD: Ferrite Bead (blocks, cores, rings, chokes, etc.) Inductor with layers of ferrite used to suppress high frequencies. Often used to isolate high frequency noise. SparkFun Products: IOIO-OTG - V2.2 <https://www.sparkfun.com/products/13613> SparkFun SAMD21 Mini Breakout <https://www.sparkfun.com/products/13664> SparkFun 6 Degrees of Freedom Breakout - LSM6DS3 <https://www.sparkfun.com/products/13339> SparkFun SAMD21 Dev Breakout <https://www.sparkfun.com/products/13672> Lilypad MP3 <https://www.sparkfun.com/products/11013>; PROD_ID: NDUC-14988
FB2 = SparkFun-Coils:FERRITE_BEAD: Ferrite Bead (blocks, cores, rings, chokes, etc.) Inductor with layers of ferrite used to suppress high frequencies. Often used to isolate high frequency noise. SparkFun Products: IOIO-OTG - V2.2 <https://www.sparkfun.com/products/13613> SparkFun SAMD21 Mini Breakout <https://www.sparkfun.com/products/13664> SparkFun 6 Degrees of Freedom Breakout - LSM6DS3 <https://www.sparkfun.com/products/13339> SparkFun SAMD21 Dev Breakout <https://www.sparkfun.com/products/13672> Lilypad MP3 <https://www.sparkfun.com/products/11013>; PROD_ID: NDUC-12579
FD1-FD4 = SparkFun-Aesthetics:FIDUCIAL: Fiducial Alignment Points Point-of-reference for pick-and-place machines and other optical instruments.
FRAME1 = SparkFun-Aesthetics:FRAME-LEDGER: Schematic Frame - Ledger Standard 11x14 US Ledger frame
H1-H10 = SparkFun-Hardware:STAND-OFF: Stand Off Drill holes for mechanically mounting via screws, standoffs, etc. Note: Use the keepout ring to avoid running the screw head into surrounding components. Variant Overviews STAND-OFF - Mechanical footprint for a #4 phillips button head screw. STAND-OFF-TIGHT - Mechanical footprint for a #4 phillips button head screw, Example SparkFun Products Screw - Phillips Head (1/4", 4-40, 10 pack) <https://www.sparkfun.com/products/10453> (PRT-10453) Screw - Phillips Head (1/2", 4-40, 10 pack) <https://www.sparkfun.com/products/10452> (PRT-10452) Screw - Phillips Head (3/4", 4-40, 10 pack) <https://www.sparkfun.com/products/10451> (PRT-10451) Screw - Phillips Head (1", 4-40, 10 pack) <https://www.sparkfun.com/products/10450> (PRT-10450)
I2C = SparkFun-Jumpers:JUMPER-SMT_3_2-NC_TRACE: Normally closed trace jumper (2 of 2 connections) This jumper has a trace between all three pads so they are normally closed (NC). Use a razor knife to open the connection(s). For best results follow the IPC guidelines for cutting traces: Cutout at least 0.063 mm (0.005 in). Remove all loose material to clean up the cut area. Seal the cut with an approved epoxy. Reapply solder to reclose the connection(s).
J1 J5 J6 = SparkFun-Connectors:USB_C: USB Type C 16Pin Connector Super Speed pins not available on the 16-pin purely SMD connector so this part is best for USB 2.0 implementations. D1 and D2 are tied together enabling D+/- no matter which way the cable is plugged into the connector. The two channel configuration pins (CC1/2) are exposed. These are normally connected to ground via 5.1k resistors but can be reconfigured for high current/high power applications. **4-LAYER BOARD WARNING!!** If designing 4-layer board, make sure to select the variant _4-LAYER-ISOLATED. The linked footprint (USB-C-16-4LAYER-ISOLATED) includes some very necessary cutout polygons in the inner layers (2 and 15). This prevents the PTH mounting shield legs on the USB connector from electrically connecting any other polygons on the inner layers (usually VCC and GND).; PROD_ID: CONN-14122
J2 J10 = SparkFun-RF:ANTENNA-SMA-GROUNDED: SMA Antenna Connector w/ Ground Edge-mount and SMD SMA connectors for RF Antennas. **4-LAYER BOARD WARNING!!** When designing a 4-layer board using any of the SMD variants, you will need to manually add a cutout polygon on any internal power layers to make sure that you don't end up with exposed copper around the edge of the routed hole for these connectors. Exposed power copper could then short to the connector body - and that would be bad. Why hasn't anyone added the cutout polygons directly to the connector footprint? Well, your internal layers (usually 2 and 15) may be covered with GND polygons and you might well want the copper to go all the way to the edge, especially under the connector SIGNAL pin. So adding cutouts to the footprint might make matters worse, not better...; PROD_ID: CONN-08289
J3 = SparkFun-Connectors:MICRO-SD: microSD Socket for Transflash Various sockets for µSD. tDoc lines correctly indicate media card edge positions when inserting (unlocked, locked, depressed). NOTE: CD1 and CD2 are connected internally, and the default detect state of the socket is detect pin to ground. SparkFun Products: WAV Trigger <https://www.sparkfun.com/products/13660> CAN-Bus Shield <https://www.sparkfun.com/products/13262> SparkFun Level Shifing microSD Breakout <https://www.sparkfun.com/products/13743>; PROD_ID: CONN-16110
J4 J11 = SparkFun-Connectors:QWIIC_CONNECTOR: SparkFun I2C Standard Qwiic Connector An SMD 1mm pitch JST connector makes it easy and quick (get it? Qwiic?) to connect I2C devices to each other. The Qwiic system <http://www.sparkfun.com/qwiic> enables fast and solderless connection between popular platforms and various sensors and actuators. We carry 200mm <https://www.sparkfun.com/products/14204>, 100mm <https://www.sparkfun.com/products/14205>, 50mm <https://www.sparkfun.com/products/14206>, and breadboard friendly <https://www.sparkfun.com/products/14207> Qwiic cables. We also offer 10 pcs strips <https://www.sparkfun.com/products/14323> the SMD connectors.; PROD_ID: CONN-14483
J7 = SparkFun-RF:ANTENNA-SMA-GROUNDED: SMA Antenna Connector w/ Ground Edge-mount and SMD SMA connectors for RF Antennas. **4-LAYER BOARD WARNING!!** When designing a 4-layer board using any of the SMD variants, you will need to manually add a cutout polygon on any internal power layers to make sure that you don't end up with exposed copper around the edge of the routed hole for these connectors. Exposed power copper could then short to the connector body - and that would be bad. Why hasn't anyone added the cutout polygons directly to the connector footprint? Well, your internal layers (usually 2 and 15) may be covered with GND polygons and you might well want the copper to go all the way to the edge, especially under the connector SIGNAL pin. So adding cutouts to the footprint might make matters worse, not better...; PROD_ID: CONN-00827
J8 = SparkFun-Connectors:U.FL2PIN: SMD Antenna Connector - U.FL 2mm height, 3.0mm x 3.0mm receptacle size. SparkFun Products: SparkFun WiFi Shield - ESP8266 <https://www.sparkfun.com/products/13287> SparkFun ESP8266 Thing <https://www.sparkfun.com/products/13231> SparkFun MiniGen - Pro Mini Signal Generator Shield <https://www.sparkfun.com/products/11420>; PROD_ID: CONN-09193
J9 = SparkFun-Connectors:MAGJACK-POE: MAGJACK: RJ-45 with POE and LEDs This is a single port, RJ45 ethernet jacks with built in transformer (magnetics), PoE rectifier diodes, status LEDs, and shielding.; PROD_ID: CONN-16253
J13 = SparkFun-Connectors:CONN_10: Multi connection point. Often used as Generic Header-pin footprint for 0.1 inch spaced/style header connections On any of the 0.1 inch spaced packages, you can populate with these: Break Away Headers - Straight <https://www.sparkfun.com/products/116> (PRT-00116) Break Away Male Headers - Right Angle <https://www.sparkfun.com/products/553> (PRT-00553) Female Headers <https://www.sparkfun.com/products/115> (PRT-00115) Break Away Headers - Machine Pin <https://www.sparkfun.com/products/117> (PRT-00117) Break Away Female Headers - Swiss Machine Pin <https://www.sparkfun.com/products/743> (PRT-00743) Arduino Stackable Header - 10 Pin <https://www.sparkfun.com/products/11376> (PRT-11376) For SCREWTERMINALS and SPRING TERMINALS visit here: Screw Terimnals on SparkFun.com <https://www.sparkfun.com/search/results?term=Screw+Terminals> (5mm/3.5mm/2.54mm spacing) This device is also useful as a general connection point to wire up your design to another part of your project. Our various solder wires solder well into these plated through hole pads. Hook-Up Wire - Assortment (Stranded, 22 AWG) <https://www.sparkfun.com/products/11375> (PRT-11375) Hook-Up Wire - Assortment (Solid Core, 22 AWG) <https://www.sparkfun.com/products/11367> (PRT-11367) View the entire wire category on our website here <https://www.sparkfun.com/categories/141> Special notes: Molex polarized connector foot print use with SKU : PRT-08231 with associated crimp pins and housings. 1MM SMD Version SKU: PRT-10208 NOTES ON THE VARIANTS LOCK and LOCK_LONGPADS... This footprint was designed to help hold the alignment of a through-hole component (i.e. 6-pin header) while soldering it into place. You may notice that each hole has been shifted either up or down by 0.005 of an inch from it's more standard position (which is a perfectly straight line). This slight alteration caused the pins (the squares in the middle) to touch the edges of the holes. Because they are alternating, it causes a "brace" to hold the component in place. 0.005 has proven to be the perfect amount of "off-center" position when using our standard breakaway headers. Although looks a little odd when you look at the bare footprint, once you have a header in there, the alteration is very hard to notice. Also,if you push a header all the way into place, it is covered up entirely on the bottom side.; PROD_ID: CONN-17279; STOREFRONT: PRT-21328
L1 = SparkFun-Coils:INDUCTOR: Inductors Resist changes in electrical current. Basically a coil of wire. SparkFun Products: SparkFun Load Cell Amplifier - HX711 <https://www.sparkfun.com/products/13879> IOIO-OTG - V2.2 <https://www.sparkfun.com/products/13613>; PROD_ID: NDUC-14234
LOGO1 = SparkFun-Aesthetics:SPECIAL_INSTRUCTIONS: Special Ordering/Production Instructions Alert Symbol for special PCB ordering instructions or unique production process warnings. Ordering Instructions Production Instructions Types of information that should be added to box: Copper weight Soldermask color Silk color PCB thickness Number of layers PCB Standard: 1.6mm FR4 1 oz copper immersion silver plating red soldermask white silkscreen Types of information that should be added to box: Special wash requirements Depaneling instructions Humidification Glue curing Default text settings: 0.07 inch 9% ratio 50% line distance
LOGO3 = SparkFun-Aesthetics:QWIIC_LOGO: Qwiic Logos for placement on schematic and PCB. The 5.5mm silk logo is best for placing next to Qwiic connector.
LOGO4 = SparkFun-Aesthetics:OSHW-LOGO: Open-Source Hardware (OSHW) Logo This logo indicates the piece of hardware it is found on incorporates a OSHW license and/or adheres to the definition of open source hardware found here: http://freedomdefined.org/OSHW
LOGO5 = SparkFun-Aesthetics:SFE_LOGO_NAME: SparkFun Font Logo This is the SparkFun name logo. The logo on the schematic will always be the same size; the package variant is the height of the flame part of the logo (or the height the flame would be, if it were drawn). Default layer for the logo on the board is tSilk.
LOGO6 = SparkFun-Aesthetics:SFE_LOGO_FLAME: SparkFun Flame Logo This is the SparkFun flame logo. The logo on the schematic will always be the same size; the package variant is the height of the flame. Default layer for the logo on the board is tSilk.
MEAS PW+ PW- = SparkFun-Jumpers:JUMPER-COMBO_2_NC_TRACE
PM0 PM1 PM2 = SparkFun-Jumpers:JUMPER-SMT_2_NO: Normally open jumper This jumper has two pads in close proximity to each other. Apply solder to close the connection. Round pads are easier to solder for beginners, but are a lot larger. SparkFun Product that uses the round pads: SparkFun EL Sequencer <https://www.sparkfun.com/products/12781>
Q1 Q2 = SparkFun-DiscreteSemi:TRANS_NPN_DUAL: Dual NPN Transistors in Single Package The MBT3904W1 puts two general purpose 3904 NPN transistors in a single package. Datasheet <http://www.onsemi.com/pub_link/Collateral/MBT3904DW1T1-D.PDF> SparkFun Products: SparkFun ESP32 Thing <https://www.sparkfun.com/products/13907>; PROD_ID: TRANS-13337
R1 R2 R27 R28 R33 R34 = SparkFun-Resistors:5.1KOHM; PROD_ID: RES-12083
R3-R5 R10-R14 R22 R30-R32 R49-R52 R54 R57 R58 = SparkFun-Resistors:10KOHM: 10kΩ resistor A resistor is a passive two-terminal electrical component that implements electrical resistance as a circuit element. Resistors act to reduce current flow, and, at the same time, act to lower voltage levels within circuits. - Wikipedia; PROD_ID: RES-00824
R6 R36-R39 R46 R47 = SparkFun-Resistors:33OHM: 33Ω resistor A resistor is a passive two-terminal electrical component that implements electrical resistance as a circuit element. Resistors act to reduce current flow, and, at the same time, act to lower voltage levels within circuits. - Wikipedia; PROD_ID: RES-08270
R7 R8 = SparkFun-Resistors:27OHM: 27Ω resistor A resistor is a passive two-terminal electrical component that implements electrical resistance as a circuit element. Resistors act to reduce current flow, and, at the same time, act to lower voltage levels within circuits. - Wikipedia; PROD_ID: RES-09334
R9 R35 R40-R42 = SparkFun-Resistors:49.9OHM: 49.9Ω resistor A resistor is a passive two-terminal electrical component that implements electrical resistance as a circuit element. Resistors act to reduce current flow, and, at the same time, act to lower voltage levels within circuits. - Wikipedia; PROD_ID: RES-16237
R15 R17 R18 R20 R21 R23 R48 = SparkFun-Resistors:100KOHM: 100kΩ resistor A resistor is a passive two-terminal electrical component that implements electrical resistance as a circuit element. Resistors act to reduce current flow, and, at the same time, act to lower voltage levels within circuits. - Wikipedia; PROD_ID: RES-07828
R16 R19 = SparkFun-Resistors:2.2KOHM: 2.2kΩ resistor A resistor is a passive two-terminal electrical component that implements electrical resistance as a circuit element. Resistors act to reduce current flow, and, at the same time, act to lower voltage levels within circuits. - Wikipedia; PROD_ID: RES-08272
R24 = SparkFun-Resistors:1MOHM: 1MΩ resistor A resistor is a passive two-terminal electrical component that implements electrical resistance as a circuit element. Resistors act to reduce current flow, and, at the same time, act to lower voltage levels within circuits. - Wikipedia; PROD_ID: RES-07868
R25 R26 R44 R53 R56 R63 = SparkFun-Resistors:1KOHM: 1kΩ resistor A resistor is a passive two-terminal electrical component that implements electrical resistance as a circuit element. Resistors act to reduce current flow, and, at the same time, act to lower voltage levels within circuits. - Wikipedia; PROD_ID: RES-07856
R29 = SparkFun-Resistors:12.4KOHM: 12.4kΩ resistor A resistor is a passive two-terminal electrical component that implements electrical resistance as a circuit element. Resistors act to reduce current flow, and, at the same time, act to lower voltage levels within circuits. - Wikipedia; PROD_ID: RES-16236
R43 = SparkFun-Resistors:10OHM: 10Ω resistor A resistor is a passive two-terminal electrical component that implements electrical resistance as a circuit element. Resistors act to reduce current flow, and, at the same time, act to lower voltage levels within circuits. - Wikipedia; PROD_ID: RES-12581
R45 R55 R59-R61 = SparkFun-Resistors:49.9OHM: 49.9Ω resistor A resistor is a passive two-terminal electrical component that implements electrical resistance as a circuit element. Resistors act to reduce current flow, and, at the same time, act to lower voltage levels within circuits. - Wikipedia; PROD_ID: RES-16252
R62 = SparkFun-Resistors:470OHM: 470Ω resistor A resistor is a passive two-terminal electrical component that implements electrical resistance as a circuit element. Resistors act to reduce current flow, and, at the same time, act to lower voltage levels within circuits. - Wikipedia; PROD_ID: RES-07869
U1 = SparkFun-RF:ESP-WROOM-32: ESP-WROOM-32D - trace antenna (includes keepout) ESP-WROOM-32U - U.FL antenna connector Includes both "standard" footprints and "narrow" version (for use with tighter layouts).; PROD_ID: IC-15442
U2 = SparkFun-IC-Comms:CH340C; PROD_ID: IC-14038
U3 U6 = SparkFun-IC-Power:XC6222; IOUT: 700mA; PROD_ID: VREG-16775; VOUT: 3.3V
U4 = SparkFun-GPS:U-BLOX_ZED-F9P; PROD_ID: IC-14209
U5 = SparkFun-IC-Special-Function:ATECC608A: ATECC608A CryptoAuthentication Device Cryptographic Co-processor with Secure Hardware-Based Key Storage ECDSA: FIPS186-3 Elliptic Curve Digital Signature Algorithm ECDH: FIPS SP800-56A Elliptic Curve Diffie-Hellman Algorithm AES Algorithm for encryption and decryption NIST Standard P256 Elliptic Curve Support SHA-256 Hash Algorithm with HMAC Option 1 MHz Standard I2C Interface 2.0V to 5.5V Supply Voltage Range 1.8V to 5.5V IO levels Datasheet (summary) <http://ww1.microchip.com/downloads/en/DeviceDoc/ATECC608A-CryptoAuthentication-Device-Summary-Data-Sheet-DS40001977B.pdf> SparkFun Products SparkFun Cryptographic Co-Processor Breakout - ATECC608A (Qwiic) <https://www.sparkfun.com/products/18077> (DEV-18077); PROD_ID: IC-15951
U7 = SparkFun-IC-Comms:W5500; PROD_ID: IC-16240
U8 = SparkFun-IC-Amplifiers:AD8045: Unity-gain stable feedback amplifier Low noise, low distortion, 1GHz BW. Datasheet <https://cdn.sparkfun.com/datasheets/BreakoutBoards/AD8045.pdf> SparkFun Products SparkFun MiniGen - Pro Mini Signal Generator Shield <https://www.sparkfun.com/products/11420> (BOB-11420); PROD_ID: IC-11224
U9 = SparkFun-IC-Logic:74HC4066_QUAD_BILATERAL_SWITCH: Nexperia Quad Bilateral Switch The 74HC4066 is a quad single pole, single throw analog switch. Each switch features two input/output terminals (nY and nZ) and an active HIGH enable input (nE). When nE is LOW, the analog switch is turned off. Inputs include clamp diodes. This enables the use of current limiting resistors to interface inputs to voltages in excess of VCC. Datasheet <https://assets.nexperia.com/documents/data-sheet/74HC_HCT4066.pdf>; PROD_ID: IC-16528
U10 = SparkFun-IC-Power:POE_PSU: A special function Power Over Ethernet module with 5V or 12V output. Comes in an SMD package.; PROD_ID: IC-16251
U11 U13 = SparkFun-IC-Amplifiers:OPA344: Single gate rail-to-rail output op-amp. Inputs extend 300mV past rails. Datasheet <http://www.ti.com/product/OPA344> SparkFun Products SparkFun Low Current Sensor <https://www.sparkfun.com/products/8883> (SEN-08883) SparkFun Electret Microphone Breakout <https://www.sparkfun.com/products/12758> (BOB-12758); PROD_ID: IC-08251
Y1 = SparkFun-Clocks:CRYSTAL-25MHZ: 25MHz Crystal; PROD_ID: XTAL-16235

## Net classes
2 3.3V: width 0.508 mm
3 RF_IN: width 0.35 mm, clearance 0.46 mm
7 V_ZED: width 0.2 mm, clearance 0.2 mm
8 V_RF: width 0.2 mm
11 ZED_DIG: width 0.1 mm, clearance 0.1 mm